# EasyEDA schematic SCH_MCU-IR_Temp-Control-Relay_2025-03-15.json
REV: 1.0; Date: 2025-03-14; Sheet: 1/1; Company: Your Company
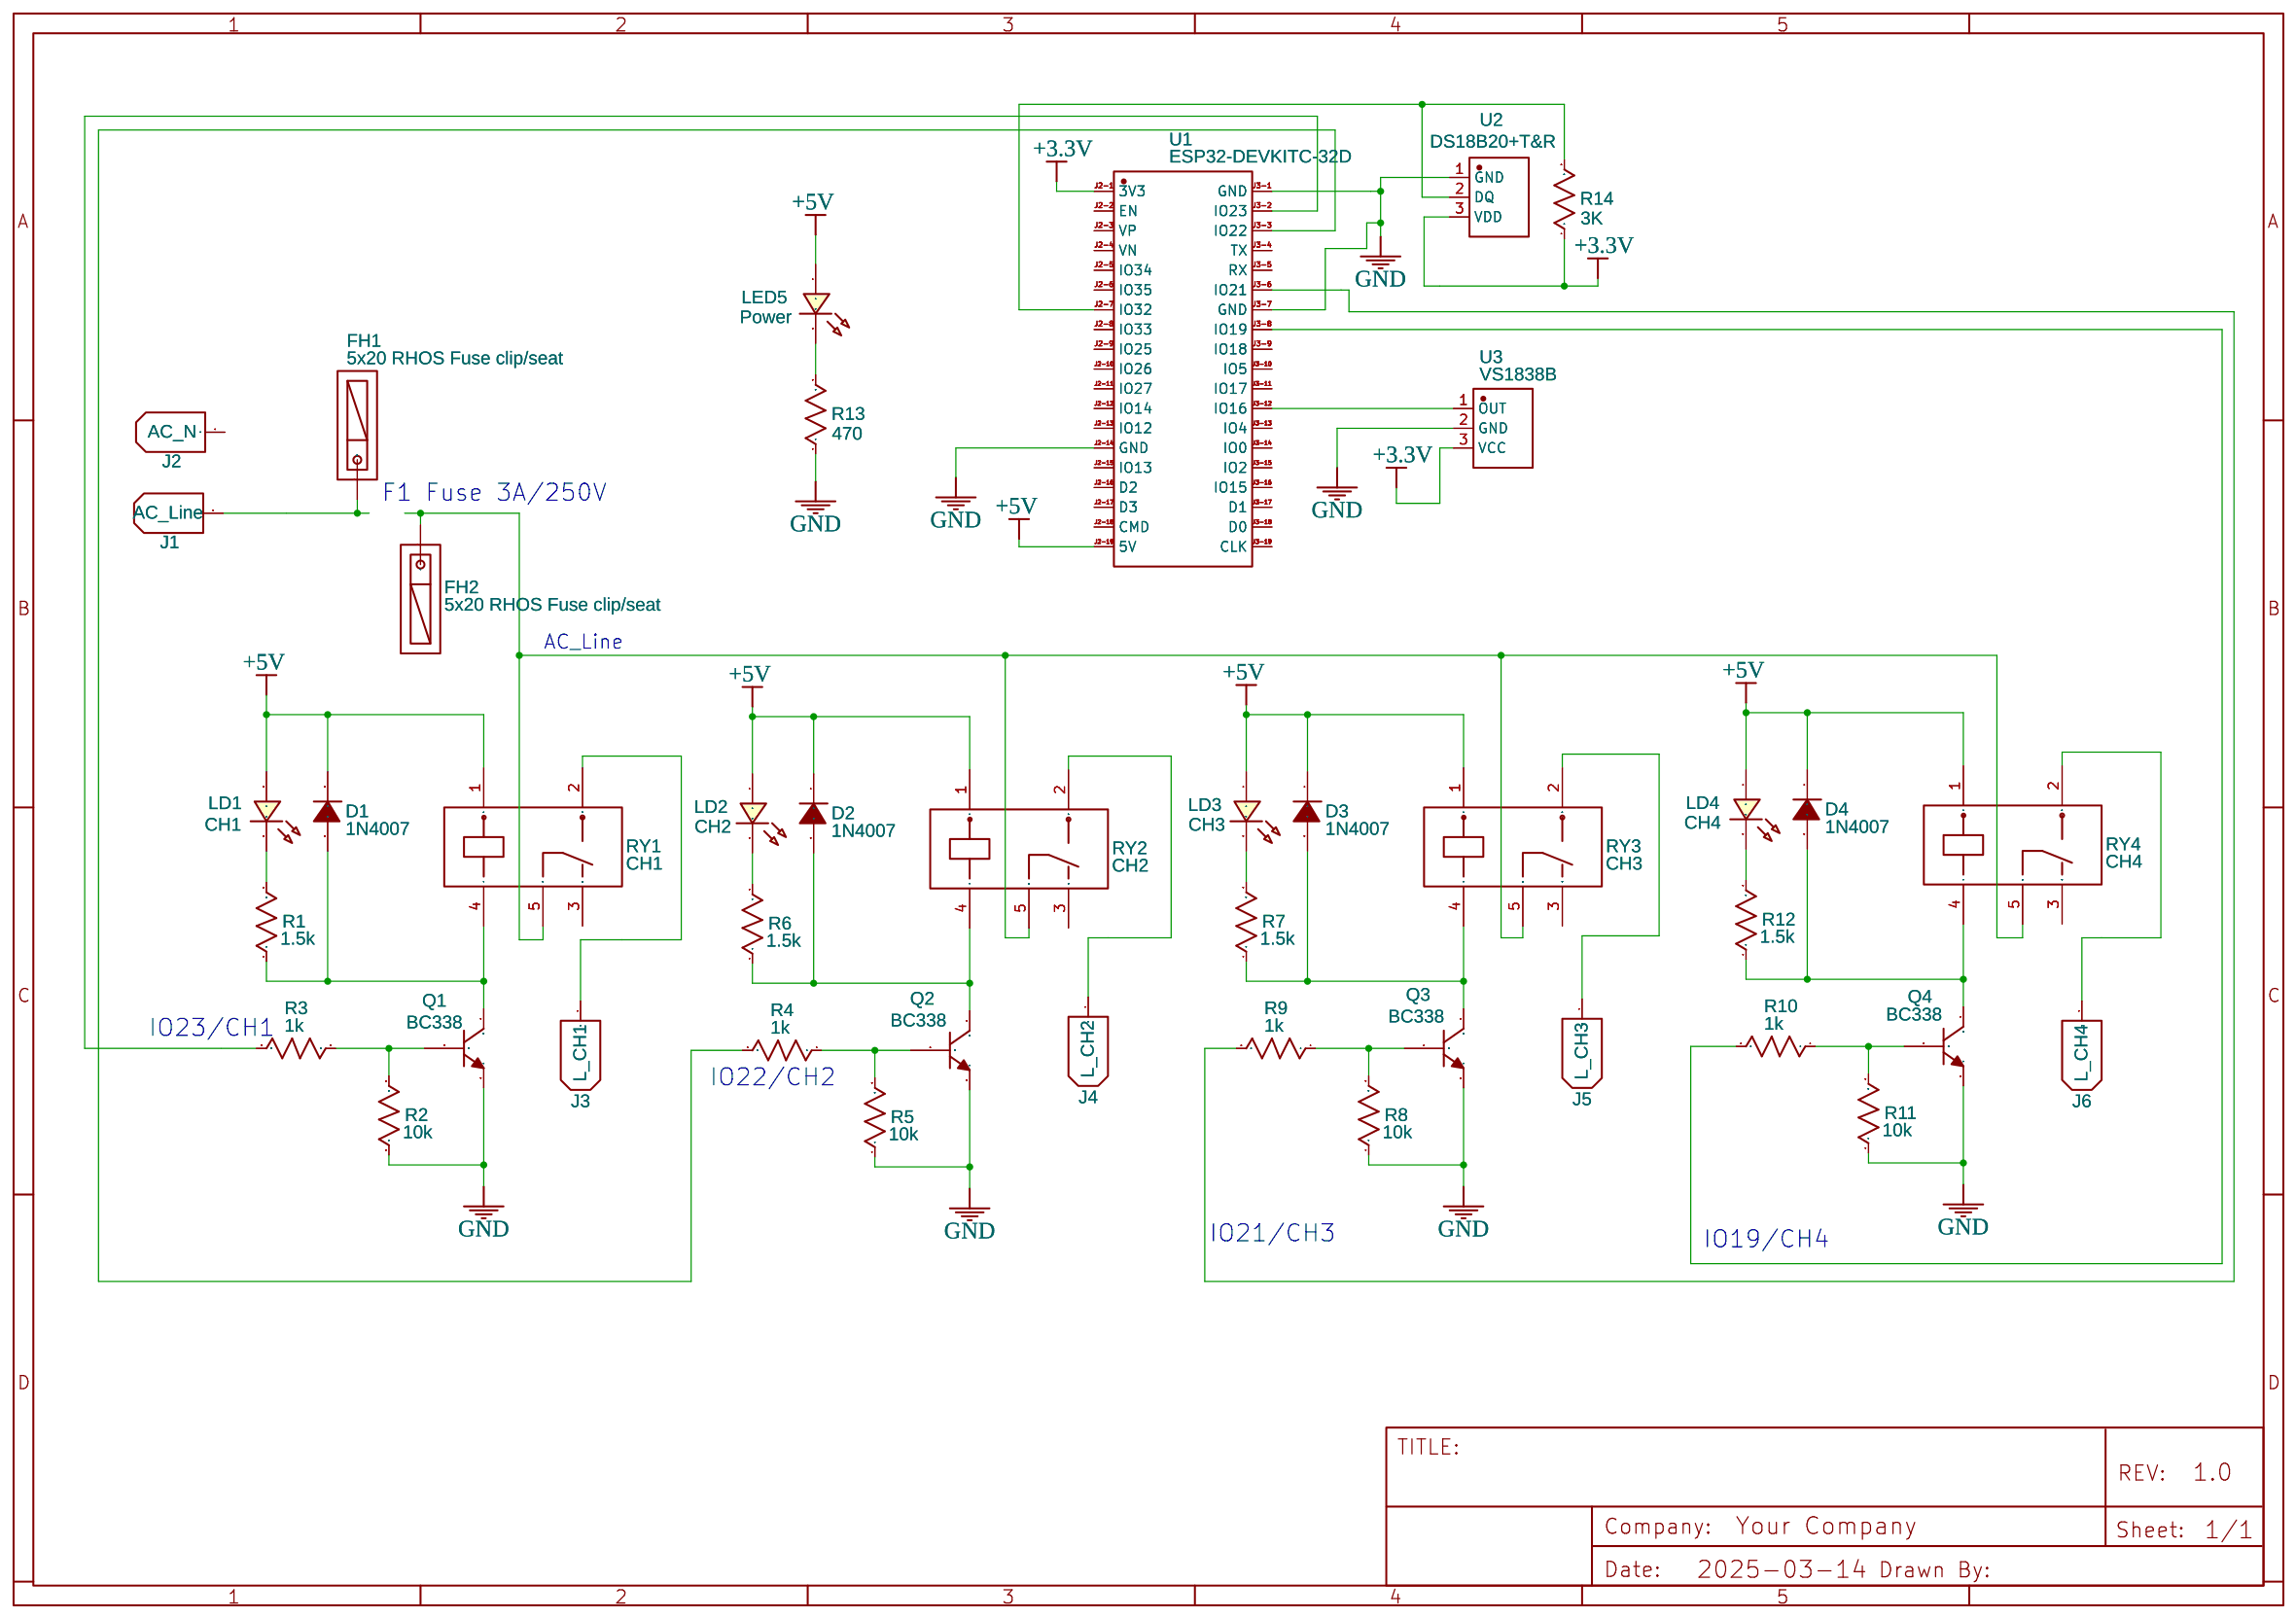
[diagram p0: schematic sheet]

## Parts
D1  1N4007  [DO-41_BD2.4-L4.7-P8.70-D0.9-RD]
D2  1N4007  [DO-41_BD2.4-L4.7-P8.70-D0.9-RD]
D3  1N4007  [DO-41_BD2.4-L4.7-P8.70-D0.9-RD]
D4  1N4007  [DO-41_BD2.4-L4.7-P8.70-D0.9-RD]
FH1  5x20 RHOS Fuse clip/seat  [FUSE-TH_5X20RHOSFUSECLIP-SEAT]
FH2  5x20 RHOS Fuse clip/seat  [FUSE-TH_5X20RHOSFUSECLIP-SEAT]
J1  AC_Line  [CONN-TH_63849-1]
J2  AC_N  [CONN-TH_63849-1]
J3  L_CH1  [CONN-TH_63849-1]
J4  L_CH2  [CONN-TH_63849-1]
J5  L_CH3  [CONN-TH_63849-1]
J6  L_CH4  [CONN-TH_63849-1]
LD1  CH1  [LED-TH_BD3.0_RED]
LD2  CH2  [LED-TH_BD3.0_RED]
LD3  CH3  [LED-TH_BD3.0_RED]
LD4  CH4  [LED-TH_BD3.0_RED]
LED5  Power  [LED-TH_BD3.0_RED]
Q1  BC338  [TO-92-3_L4.9-W3.7-P2.54-L]
Q2  BC338  [TO-92-3_L4.9-W3.7-P2.54-L]
Q3  BC338  [TO-92-3_L4.9-W3.7-P2.54-L]
Q4  BC338  [TO-92-3_L4.9-W3.7-P2.54-L]
R1  1.5k  [R_AXIAL-0.3]
R2  10k  [R_AXIAL-0.3]
R3  1k  [R_AXIAL-0.3]
R4  1k  [R_AXIAL-0.3]
R5  10k  [R_AXIAL-0.3]
R6  1.5k  [R_AXIAL-0.3]
R7  1.5k  [R_AXIAL-0.3]
R8  10k  [R_AXIAL-0.3]
R9  1k  [R_AXIAL-0.3]
R10  1k  [R_AXIAL-0.3]
R11  10k  [R_AXIAL-0.3]
R12  1.5k  [R_AXIAL-0.3]
R13  470  [R_AXIAL-0.3]
R14  3K  [R_AXIAL-0.3]
RY1  CH1  [RELAY-TH_SRD-XXVDC-XL-C]
RY2  CH2  [RELAY-TH_SRD-XXVDC-XL-C]
RY3  CH3  [RELAY-TH_SRD-XXVDC-XL-C]
RY4  CH4  [RELAY-TH_SRD-XXVDC-XL-C]
U1  ESP32-DEVKITC-32D  [COMM-SMD_ESP32-DEVKITC-32D]
U2  DS18B20+T&R  [TO-92-3_L4.9-W3.7-P2.54-L]
U3  VS1838B  [OPTO-TH_VS1838B]

## Library data of the parts
D1-D4 = 1N4007: Supplier: LCSC; Manufacturer: ST(先科); Supplier Part: C106903; JLCPCB Part Class: Extended Part
FH1 FH2 = 5x20 RHOS Fuse clip/seat: Contributor: LCSC; Supplier: LCSC; Manufacturer: xcfuse(旭程); Manufacturer Part: 5x20 环保 保险管夹/座; Supplier Part: C3130; JLCPCB Part Class: Extended Part
J1-J6 = 63849-1: Contributor: LCSC; Supplier: LCSC; Supplier Part: C86469; Manufacturer: TE Connectivity(美国泰科); JLCPCB Part Class: Extended Part
LD1-LD4 LED5 = LED-TH-3mm_R: Manufacturer: EVERLIGHT(台湾亿光); Manufacturer Part: 204-10SDRD/S530-A3-L; Supplier Part: C84774; Supplier: LCSC; Contributor: LCEDA_Lib
Q1-Q4 = BC547BTF: Contributor: LCSC; Supplier: LCSC; Supplier Part: C900798; Manufacturer: onsemi(安森美); JLCPCB Part Class: Extended Part
R1-R14 = R_AXIAL-0.3_US: Contributor: LCEDA_Lib
RY1-RY4 = SRD-12VDC-SL-C: Supplier: LCSC; Manufacturer: 松乐; Supplier Part: C30431; JLCPCB Part Class: Extended Part
U1 = ESP32-DEVKITC-32D: Supplier: LCSC; Supplier Part: C571181; Manufacturer: ESPRESSIF(乐鑫); Manufacturer Part: ESP32-DevKitC-32D; JLCPCB Part Class: Extended Part; Contributor: lcsc
U2 = DS18B20+T&amp;R: Contributor: LCSC; Supplier: LCSC; Supplier Part: C880672; Manufacturer: ADI(亚德诺)/MAXIM(美信); JLCPCB Part Class: Extended Part
U3 = VS1838B: Contributor: LCSC; Supplier: LCSC; Supplier Part: C9900002107; Manufacturer: null; JLCPCB Part Class: Extended Part

## Nets
+3.3V: R14.1 U1.J2-1(3V3) U2.3(VDD) U3.3(VCC)
+5V: D1.1(K) D2.1(K) D3.1(K) D4.1(K) LD1.1 LD2.1 LD3.1 LD4.1 LED5.1 RY1.1 RY2.1 RY3.1 RY4.1 U1.J2-19(5V)
GND: Q1.3(E) Q2.3(E) Q3.3(E) Q4.3(E) R2.1 R5.1 R8.1 R11.1 R13.1 U1.J2-14(GND) U1.J3-1(GND) U1.J3-7(GND) U2.1(GND) U3.2(GND)
Net-(D1-2): D1.2(A) Q1.1(C) R1.1 RY1.4
Net-(D2-2): D2.2(A) Q2.1(C) R6.1 RY2.4
Net-(D3-2): D3.2(A) Q3.1(C) R7.1 RY3.4
Net-(D4-2): D4.2(A) Q4.1(C) R12.1 RY4.4
Net-(FH1-1): FH1.1 J1.1
Net-(FH2-1): FH2.1 RY1.5 RY2.5 RY3.5 RY4.5
Net-(J3-1): J3.1 RY1.2
Net-(J4-1): J4.1 RY2.2
Net-(J5-1): J5.1 RY3.2
Net-(J6-1): J6.1 RY4.2
Net-(LD1-2): LD1.2 R1.2
Net-(LD2-2): LD2.2 R6.2
Net-(LD3-2): LD3.2 R7.2
Net-(LD4-2): LD4.2 R12.2
Net-(LED5-2): LED5.2 R13.2
Net-(Q1-2): Q1.2(B) R2.2 R3.1
Net-(Q2-2): Q2.2(B) R4.1 R5.2
Net-(Q3-2): Q3.2(B) R8.2 R9.1
Net-(Q4-2): Q4.2(B) R10.1 R11.2
Net-(R3-2): R3.2 U1.J3-2(IO23)
Net-(R4-2): R4.2 U1.J3-3(IO22)
Net-(R9-2): R9.2 U1.J3-6(IO21)
Net-(R10-2): R10.2 U1.J3-8(IO19)
Net-(R14-2): R14.2 U1.J2-7(IO32) U2.2(DQ)
Net-(U1-J3-12): U1.J3-12(IO16) U3.1(OUT)

Not connected (* = marked no-connect by the designer): J2 1; RY1 3; RY2 3; RY3 3; RY4 3; U1 J2-2(EN) J2-3(VP) J2-4(VN) J2-5(IO34) J2-6(IO35) J2-8(IO33) J2-9(IO25) J2-10(IO26) J2-11(IO27) J2-12(IO14) J2-13(IO12) J2-15(IO13) J2-16(D2) J2-17(D3) J2-18(CMD) J3-4(TX) J3-5(RX) J3-9(IO18) J3-10(IO5) J3-11(IO17) J3-13(IO4) J3-14(IO0) J3-15(IO2) J3-16(IO15) J3-17(D1) J3-18(D0) J3-19(CLK)

## Notes on the sheet
- F1 Fuse 3A/250V
- AC_Line
- IO23/CH1
- IO22/CH2
- IO21/CH3
- IO19/CH4
